# EAGLE design Line_follower (EAGLE 9.6.2)
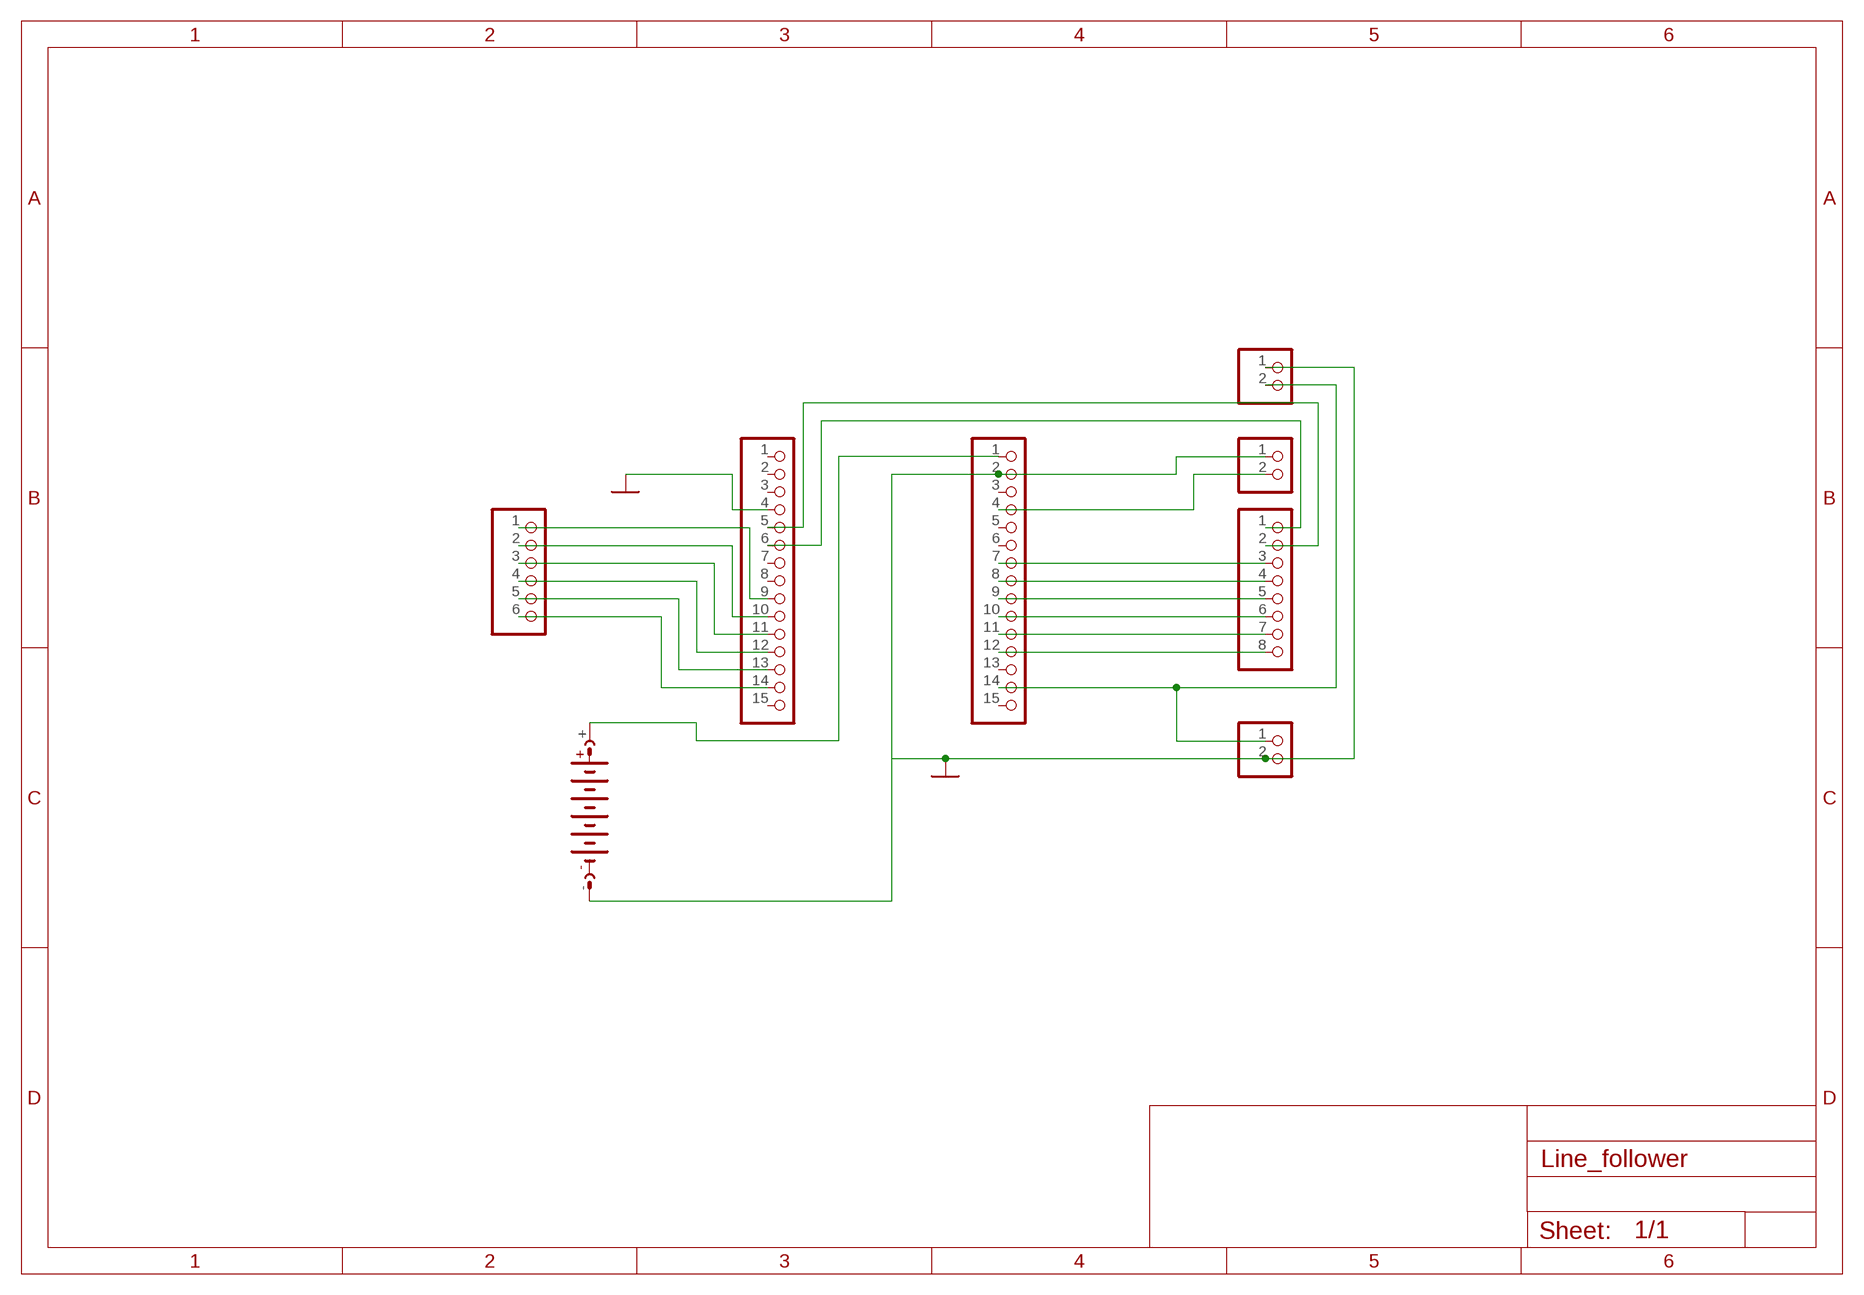
[diagram p0: schematic, sheet 1]

## Parts
G1  AB9V  [AB9V]
JP1  PINHD-1X15  [1X15]
JP2  PINHD-1X15  [1X15]
JP3  PINHD-1X8  [1X08]
JP4  PINHD-1X6  [1X06]
JP5  PINHD-1X2  [1X02]
JP6  PINHD-1X2  [1X02]
JP7  PINHD-1X2  [1X02]

## Nets
GND: G1.- JP1.4 JP2.2 JP5.1 JP6.2 JP7.1
N$1: JP1.14 JP4.6
N$2: JP1.13 JP4.5
N$3: JP1.12 JP4.4
N$4: JP1.11 JP4.3
N$5: JP1.10 JP4.2
N$6: JP1.9 JP4.1
N$7: JP2.12 JP3.8
N$8: JP2.11 JP3.7
N$9: JP2.10 JP3.6
N$10: JP2.9 JP3.5
N$11: JP2.8 JP3.4
N$12: JP2.7 JP3.3
N$13: JP1.5 JP3.2
N$14: JP2.4 JP7.2
N$15: JP2.14 JP5.2 JP6.1
N$16: G1.+ JP2.1
N$18: JP1.6 JP3.1
Unconnected: JP1.1 JP1.2 JP1.3 JP1.7 JP1.8 JP1.15 JP2.3 JP2.5 JP2.6 JP2.13 JP2.15

## Library data of the parts
G1 = battery:AB9V: 9-V BATTERY CLIP
JP1 JP2 = pinhead:PINHD-1X15: PIN HEADER
JP3 = pinhead:PINHD-1X8: PIN HEADER
JP4 = pinhead:PINHD-1X6: PIN HEADER
JP5-JP7 = pinhead:PINHD-1X2: PIN HEADER

## Board
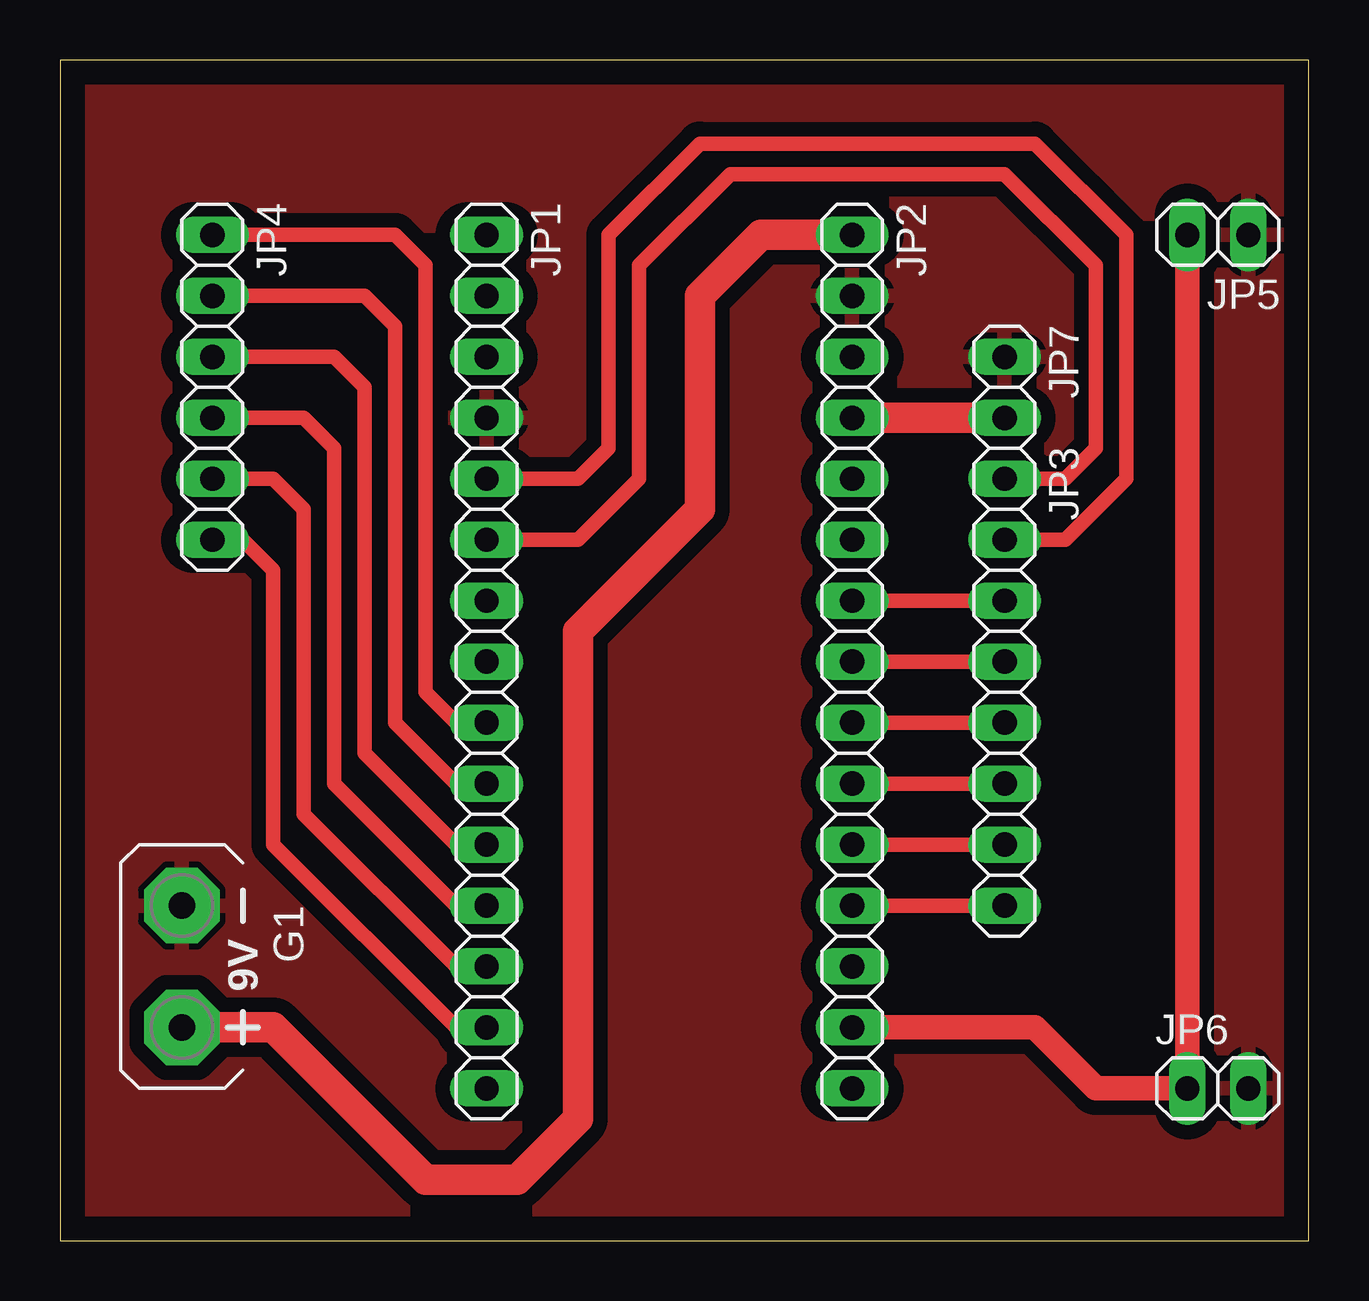
[diagram p1: board, top side]

Size 52.05 x 49.2 mm. Coordinates in mm from the lower left corner, seen from the top.
Outline: 0,0 52.05,0 52.05,49.2 0,49.2 0,0
Copper layers (1*16): Top 0.035mm / dielectric 1.5mm / Bottom 0.035mm
Design rules "default": minimum track width 6mil, minimum drill 0.35mm, track to track 6mil, track to pad 6mil, pad to pad 6mil, via to via 6mil, smd to smd 6mil, copper to edge 40mil, drill to drill 6mil, minimum pad ring 10mil, minimum via ring 8mil, stop-mask expansion 4mil, vias tented up to drill 0mil, thermal gap 10mil

### Footprints (pad centres in the part's own frame; a part is rotated, then mirrored left to right if it is on the bottom)
AB9V = drill 1.118 pad 3.15 octagon: + 0,2.54; - 0,-2.54
1X15 = drill 1.016 long: 1 -17.78,0; 2 -15.24,0; 3 -12.7,0; 4 -10.16,0; 5 -7.62,0; 6 -5.08,0; 7 -2.54,0; 8 0,0; 9 2.54,0; 10 5.08,0; 11 7.62,0; 12 10.16,0; 13 12.7,0; 14 15.24,0; 15 17.78,0
1X08 = drill 1.016 long: 1 -8.89,0; 2 -6.35,0; 3 -3.81,0; 4 -1.27,0; 5 1.27,0; 6 3.81,0; 7 6.35,0; 8 8.89,0
1X06 = drill 1.016 long: 1 -6.35,0; 2 -3.81,0; 3 -1.27,0; 4 1.27,0; 5 3.81,0; 6 6.35,0
1X02 = drill 1.016 long: 1 -1.27,0; 2 1.27,0

### Placement (x,y rotation side)
G1  5.08,11.43 180 top
JP1  17.78,24.13 270 top
JP2  33.02,24.13 270 top
JP3  39.37,22.86 270 top
JP4  6.35,35.56 270 top
JP5  48.26,41.91 180 top
JP6  48.26,6.35 0 top
JP7  39.37,35.56 270 top

### Tracks (layer width: path | path; a pad name or v marks a point on that pad's centre or on a via)
GND
  pour Top (isolate 0.61): 1.27,0 1.27,49.53 52.07,49.53 52.07,0
N$1
  Top 0.61: JP4.6 7.62,29.21 8.89,27.94 8.89,16.51 16.51,8.89 JP1.14
N$2
  Top 0.61: JP4.5 8.89,31.75 10.16,30.48 10.16,17.78 16.51,11.43 JP1.13
N$3
  Top 0.61: JP4.4 10.16,34.29 11.43,33.02 11.43,19.05 16.51,13.97 JP1.12
N$4
  Top 0.61: JP4.3 11.43,36.83 12.7,35.56 12.7,20.32 16.51,16.51 JP1.11
N$5
  Top 0.61: JP4.2 12.7,39.37 13.97,38.1 13.97,21.59 16.51,19.05 JP1.10
N$6
  Top 0.61: JP4.1 13.97,41.91 15.24,40.64 15.24,22.86 16.51,21.59 JP1.9
N$7
  Top 0.61: JP2.12 JP3.8
N$8
  Top 0.61: JP2.11 JP3.7
N$9
  Top 0.61: JP2.10 JP3.6
N$10
  Top 0.61: JP2.9 JP3.5
N$11
  Top 0.61: JP2.8 JP3.4
N$12
  Top 0.61: JP2.7 JP3.3
N$13
  Top 0.61: JP1.5 21.59,31.75 22.86,33.02 22.86,41.91 26.67,45.72 40.64,45.72 44.45,41.91 44.45,31.75 41.91,29.21 JP3.2
N$14
  Top 1.27: JP2.4 JP7.2
N$15
  Top 1.016: JP5.2 JP6.1 43.18,6.35 40.64,8.89 JP2.14
N$16
  Top 1.27: JP2.1 29.21,41.91 26.67,39.37 26.67,30.48 21.59,25.4 21.59,5.08 19.05,2.54 15.24,2.54 8.89,8.89 G1.+
N$18
  Top 0.61: JP1.6 21.59,29.21 24.13,31.75 24.13,40.64 27.94,44.45 39.37,44.45 43.18,40.64 43.18,33.02 41.91,31.75 JP3.1